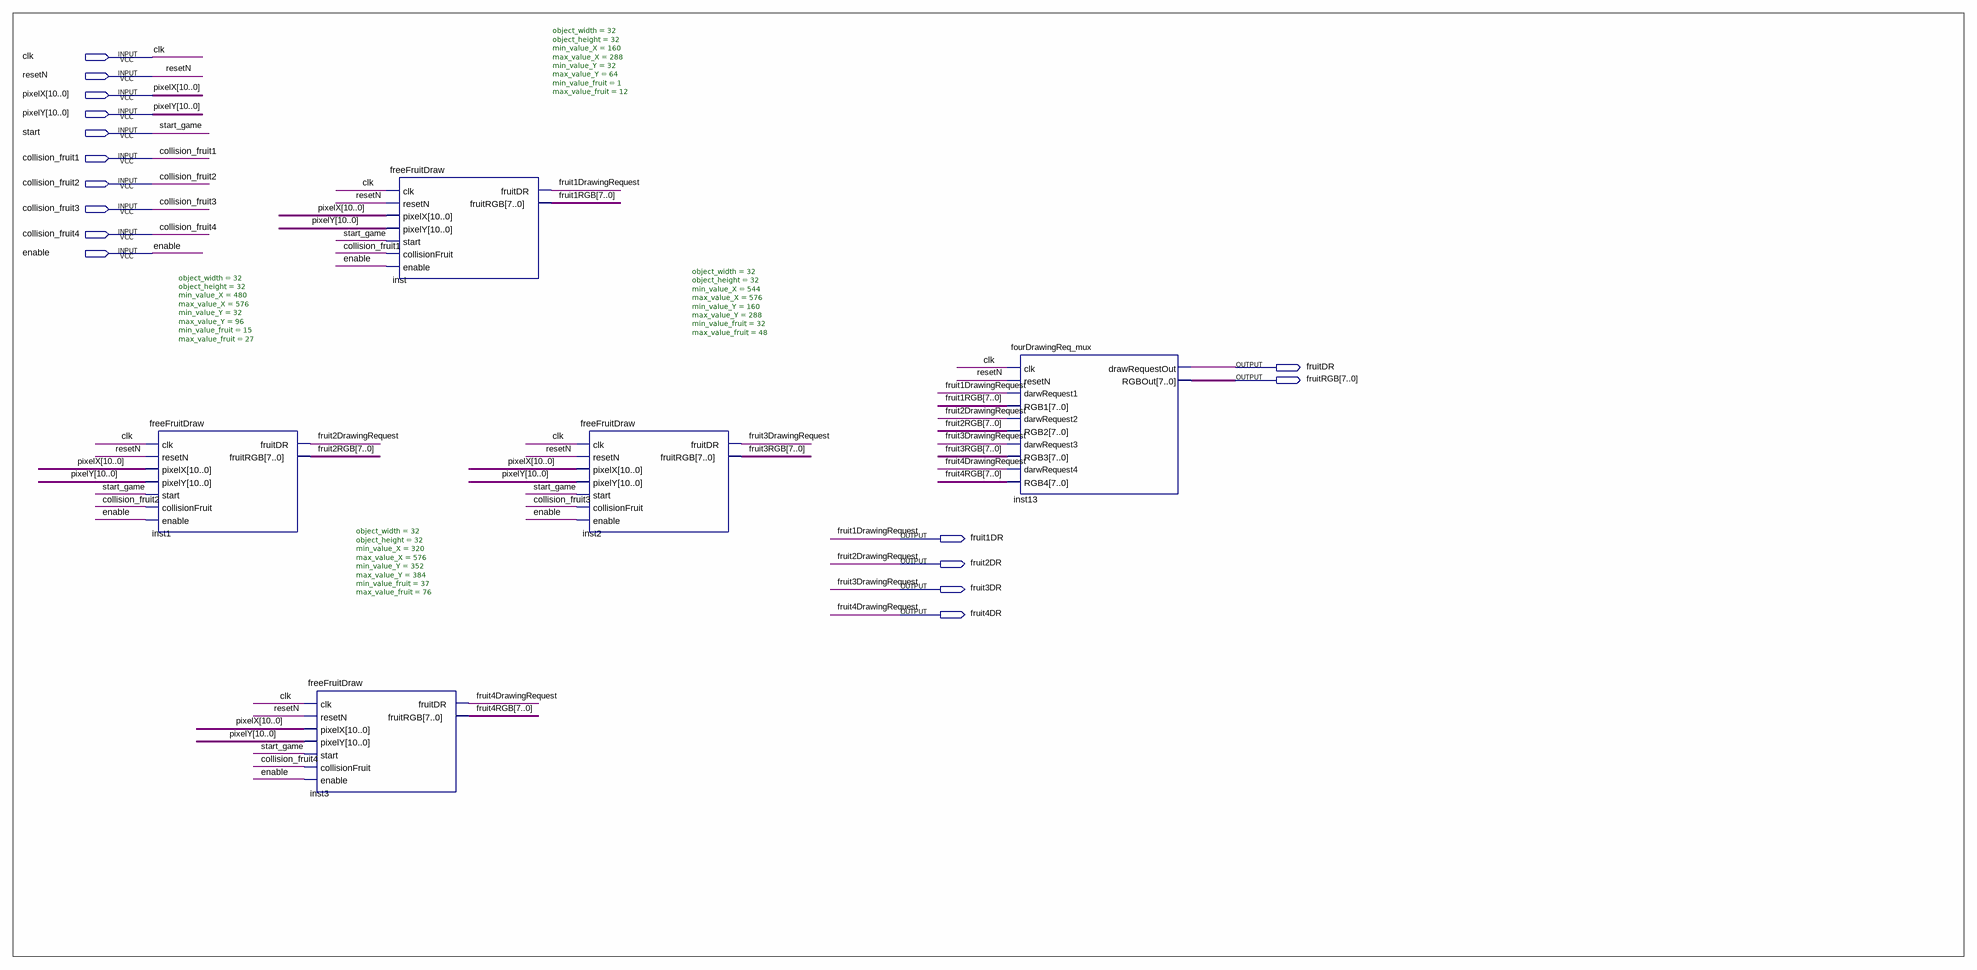
[diagram p0: schematic sheet]
// Quartus schematic freeFruitBlock.bdf as structural Verilog: 5 symbols, 16 pins
module freeFruitBlock (
  input  clk,
  input  resetN,
  input  [10:0] pixelX,
  input  [10:0] pixelY,
  input  start,
  input  collision_fruit1,
  input  collision_fruit2,
  input  collision_fruit3,
  input  collision_fruit4,
  input  enable,
  output fruitDR,
  output [7:0] fruitRGB,
  output fruit1DR,
  output fruit2DR,
  output fruit3DR,
  output fruit4DR
);

  wire [7:0] fruit1RGB, fruit2RGB, fruit3RGB, fruit4RGB;

  freeFruitDraw #(.object_width(32), .object_height(32), .min_value_X(480), .max_value_X(576), .min_value_Y(32), .max_value_Y(96), .min_value_fruit(15), .max_value_fruit(27)) inst1 (
    .clk(clk), .resetN(resetN), .pixelX(pixelX), .pixelY(pixelY), .start(start),
    .collisionFruit(collision_fruit2), .enable(enable), .fruitDR(fruit2DR), .fruitRGB(fruit2RGB));
  freeFruitDraw #(.object_width(32), .object_height(32), .min_value_X(320), .max_value_X(576), .min_value_Y(352), .max_value_Y(384), .min_value_fruit(37), .max_value_fruit(76)) inst3 (
    .clk(clk), .resetN(resetN), .pixelX(pixelX), .pixelY(pixelY), .start(start),
    .collisionFruit(collision_fruit4), .enable(enable), .fruitDR(fruit4DR), .fruitRGB(fruit4RGB));
  freeFruitDraw #(.object_width(32), .object_height(32), .min_value_X(160), .max_value_X(288), .min_value_Y(32), .max_value_Y(64), .min_value_fruit(1), .max_value_fruit(12)) inst (
    .clk(clk), .resetN(resetN), .pixelX(pixelX), .pixelY(pixelY), .start(start),
    .collisionFruit(collision_fruit1), .enable(enable), .fruitDR(fruit1DR), .fruitRGB(fruit1RGB));
  freeFruitDraw #(.object_width(32), .object_height(32), .min_value_X(544), .max_value_X(576), .min_value_Y(160), .max_value_Y(288), .min_value_fruit(32), .max_value_fruit(48)) inst2 (
    .clk(clk), .resetN(resetN), .pixelX(pixelX), .pixelY(pixelY), .start(start),
    .collisionFruit(collision_fruit3), .enable(enable), .fruitDR(fruit3DR), .fruitRGB(fruit3RGB));
  fourDrawingReq_mux inst13 (
    .clk(clk), .resetN(resetN), .darwRequest1(fruit1DR), .RGB1(fruit1RGB), .darwRequest2(fruit2DR),
    .RGB2(fruit2RGB), .darwRequest3(fruit3DR), .RGB3(fruit3RGB), .darwRequest4(fruit4DR), .RGB4(fruit4RGB),
    .drawRequestOut(fruitDR), .RGBOut(fruitRGB));

  // Other names for the same wires on the sheet: fruit1DrawingRequest = fruit1DR; fruit2DrawingRequest = fruit2DR;
  //   fruit3DrawingRequest = fruit3DR; fruit4DrawingRequest = fruit4DR; start_game = start
endmodule
